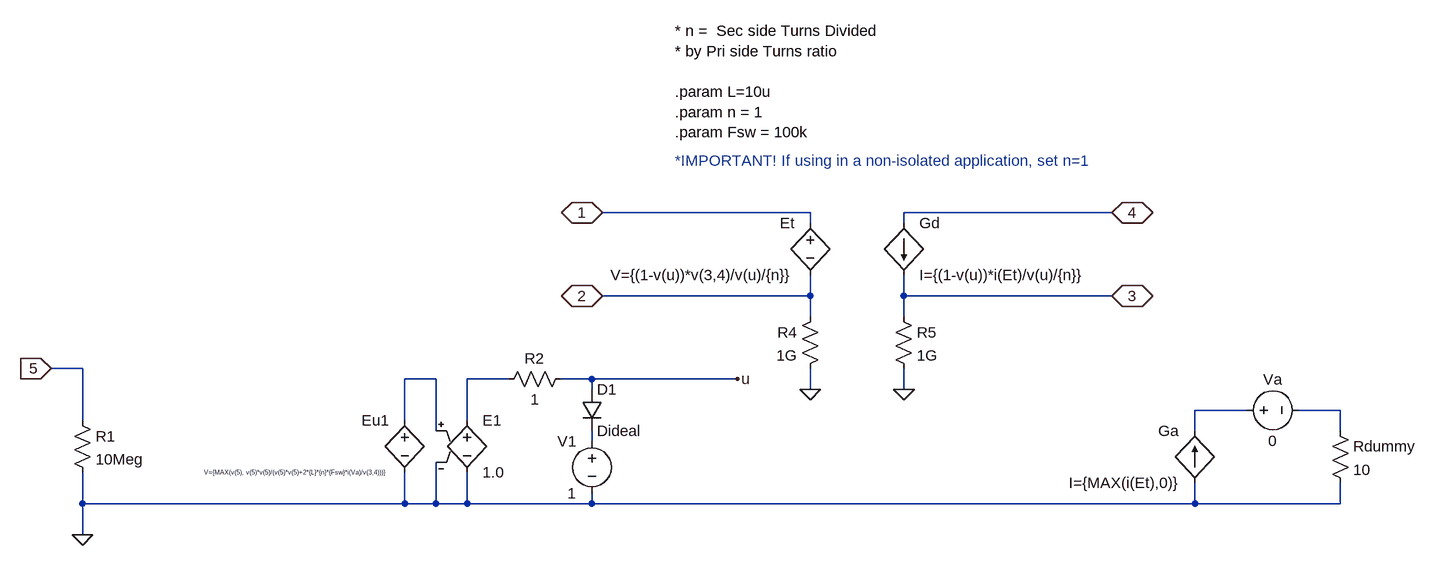
[diagram p0: schematic ccm-dcm2.asc]
ccm-dcm2.asc, the LTspice schematic file:
Version 4.1
SHEET 1 1388 680
WIRE 432 -224 112 -224
WIRE 896 -224 576 -224
WIRE 432 -208 432 -224
WIRE 576 -208 576 -224
WIRE 432 -96 432 -128
WIRE 432 -96 112 -96
WIRE 576 -96 576 -128
WIRE 896 -96 576 -96
WIRE 432 -64 432 -96
WIRE 576 -64 576 -96
WIRE -688 16 -736 16
WIRE -144 32 -192 32
WIRE -32 32 -96 32
WIRE 96 32 48 32
WIRE 320 32 96 32
WIRE 96 48 96 32
WIRE 432 48 432 16
WIRE 576 48 576 16
WIRE 1104 80 1024 80
WIRE 1248 80 1184 80
WIRE -688 96 -688 16
WIRE -192 96 -192 32
WIRE -96 96 -96 32
WIRE -144 112 -144 32
WIRE 1024 112 1024 80
WIRE 1248 112 1248 80
WIRE 96 128 96 112
WIRE -688 224 -688 176
WIRE -192 224 -192 176
WIRE -192 224 -688 224
WIRE -144 224 -144 160
WIRE -144 224 -192 224
WIRE -96 224 -96 176
WIRE -96 224 -144 224
WIRE 96 224 96 208
WIRE 96 224 -96 224
WIRE 1024 224 1024 192
WIRE 1024 224 96 224
WIRE 1248 224 1248 192
WIRE 1248 224 1024 224
WIRE -688 272 -688 224
FLAG -736 16 5
IOPIN -736 16 In
FLAG 320 32 u
FLAG 896 -224 4
IOPIN 896 -224 BiDir
FLAG 896 -96 3
IOPIN 896 -96 BiDir
FLAG 112 -224 1
IOPIN 112 -224 BiDir
FLAG 112 -96 2
IOPIN 112 -96 BiDir
FLAG -688 272 0
FLAG 432 48 0
FLAG 576 48 0
SYMBOL bv -192 80 M0
WINDOW 3 24 96 Left 0
SYMATTR Value V={MAX(v(5), v(5)*v(5)/(v(5)*v(5)+2*{L}*{n}*{Fsw}*i(Va)/v(3,4)))}
SYMATTR InstName Eu1
SYMBOL bv 432 -224 M0
SYMATTR InstName Et
SYMATTR Value V={(1-v(u))*v(3,4)/v(u)/{n}}
SYMBOL bi 576 -208 R0
SYMATTR InstName Gd
SYMATTR Value I={(1-v(u))*i(Et)/v(u)/{n}}
SYMBOL bi 1024 192 R180
WINDOW 0 24 80 Left 2
WINDOW 3 24 0 Left 2
SYMATTR InstName Ga
SYMATTR Value I={MAX(i(Et),0)}
SYMBOL voltage 1088 80 R270
WINDOW 0 32 56 VTop 2
WINDOW 3 -32 56 VBottom 2
WINDOW 123 0 0 Left 0
WINDOW 39 0 0 Left 0
SYMATTR InstName Va
SYMATTR Value 0
SYMBOL res 1232 96 R0
SYMATTR InstName Rdummy
SYMATTR Value 10
SYMBOL e -96 80 R0
SYMATTR InstName E1
SYMATTR Value 1.0
SYMBOL res 64 16 R90
WINDOW 0 0 56 VBottom 2
WINDOW 3 32 56 VTop 2
SYMATTR InstName R2
SYMATTR Value 1
SYMBOL diode 80 48 R0
SYMATTR InstName D1
SYMATTR Value Dideal
SYMBOL voltage 96 112 M0
WINDOW 123 0 0 Left 0
WINDOW 39 0 0 Left 0
SYMATTR InstName V1
SYMATTR Value 1
SYMBOL res -704 80 R0
SYMATTR InstName R1
SYMATTR Value 10Meg
SYMBOL res 448 -80 M0
SYMATTR InstName R4
SYMATTR Value 1G
SYMBOL res 560 -80 R0
SYMATTR InstName R5
SYMATTR Value 1G
TEXT 224 -504 Left 2 !* n =  Sec side Turns Divided\n* by Pri side Turns ratio\n \n.param L=10u\n.param n = 1\n.param Fsw = 100k
TEXT 224 -304 Left 2 ;*IMPORTANT! If using in a non-isolated application, set n=1

The netlist it stands for:
* ccm-dcm2.asc
B§Eu1 N001 0 V={MAX(v(5), v(5)*v(5)/(v(5)*v(5)+2*{L}*{n}*{Fsw}*i(Va)/v(3,4)))}
B§Et 1 2 V={(1-v(u))*v(3,4)/v(u)/{n}}
B§Gd 4 3 I={(1-v(u))*i(Et)/v(u)/{n}}
B§Ga 0 N003 I={MAX(i(Et),0)}
Va N003 N004 0
Rdummy N004 0 10
E1 N002 0 N001 0 1.0
R2 u N002 1
D1 u N005 Dideal
V1 N005 0 1
R1 5 0 10Meg
R4 2 0 1G
R5 3 0 1G
.model D D
.lib standard.dio
* n =  Sec side Turns Divided
* by Pri side Turns ratio
.param L=10u
.param n = 1
.param Fsw = 100k
* *IMPORTANT! If using in a non-isolated application, set n=1
.backanno
.end